# EAGLE design P1001-001-013-320 - Bus Debugger (EAGLE 9.4.2)
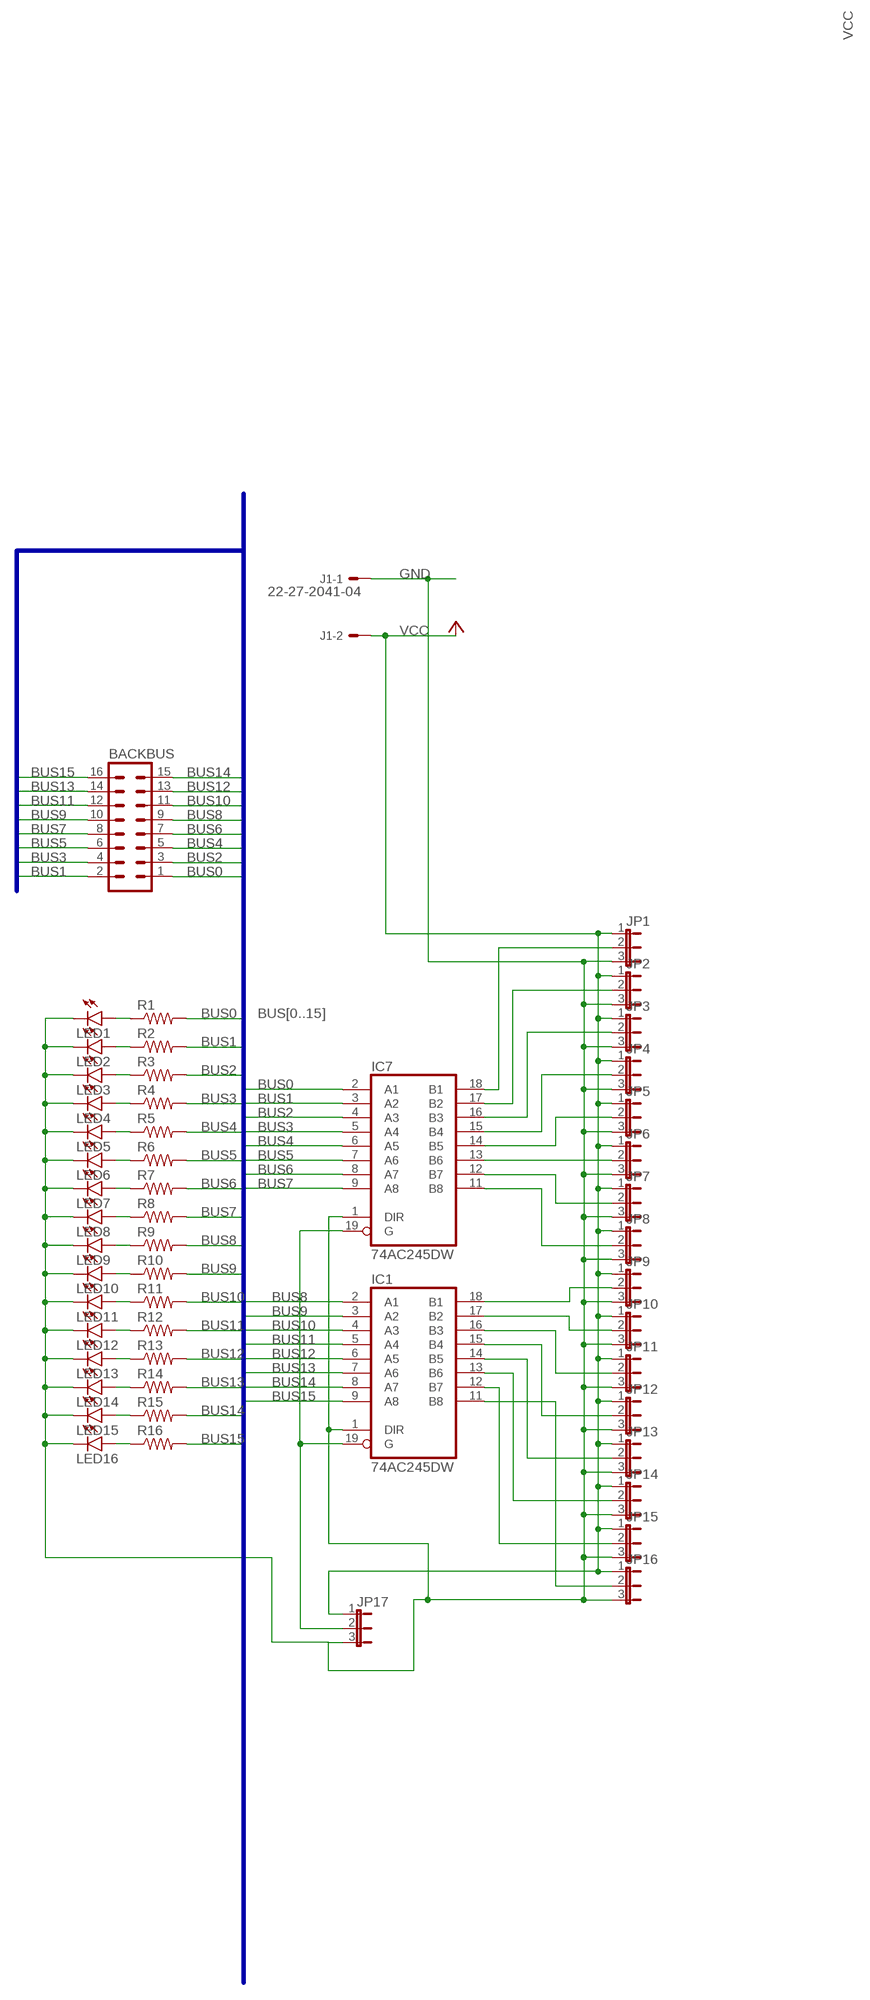
[diagram p0: schematic, sheet 1]

## Parts
BACKBUS  ML16  [ML16]
IC1  74AC245DW  [SO20W]
IC7  74AC245DW  [SO20W]
J1  22-27-2041-04  [6410-04]
JP1  JP2E  [JP2]
JP2  JP2E  [JP2]
JP3  JP2E  [JP2]
JP4  JP2E  [JP2]
JP5  JP2E  [JP2]
JP6  JP2E  [JP2]
JP7  JP2E  [JP2]
JP8  JP2E  [JP2]
JP9  JP2E  [JP2]
JP10  JP2E  [JP2]
JP11  JP2E  [JP2]
JP12  JP2E  [JP2]
JP13  JP2E  [JP2]
JP14  JP2E  [JP2]
JP15  JP2E  [JP2]
JP16  JP2E  [JP2]
JP17  JP2E  [JP2]
LED1  LED5MM  [LED5MM]
LED2  LED5MM  [LED5MM]
LED3  LED5MM  [LED5MM]
LED4  LED5MM  [LED5MM]
LED5  LED5MM  [LED5MM]
LED6  LED5MM  [LED5MM]
LED7  LED5MM  [LED5MM]
LED8  LED5MM  [LED5MM]
LED9  LED5MM  [LED5MM]
LED10  LED5MM  [LED5MM]
LED11  LED5MM  [LED5MM]
LED12  LED5MM  [LED5MM]
LED13  LED5MM  [LED5MM]
LED14  LED5MM  [LED5MM]
LED15  LED5MM  [LED5MM]
LED16  LED5MM  [LED5MM]
R1  R-US_0204/2V  [0204V]
R2  R-US_0204/2V  [0204V]
R3  R-US_0204/2V  [0204V]
R4  R-US_0204/2V  [0204V]
R5  R-US_0204/2V  [0204V]
R6  R-US_0204/2V  [0204V]
R7  R-US_0204/2V  [0204V]
R8  R-US_0204/2V  [0204V]
R9  R-US_0204/2V  [0204V]
R10  R-US_0204/2V  [0204V]
R11  R-US_0204/2V  [0204V]
R12  R-US_0204/2V  [0204V]
R13  R-US_0204/2V  [0204V]
R14  R-US_0204/2V  [0204V]
R15  R-US_0204/2V  [0204V]
R16  R-US_0204/2V  [0204V]

## Nets
BUS0: BACKBUS.1 IC7.2(A1) R1.2
BUS1: BACKBUS.2 IC7.3(A2) R2.2
BUS2: BACKBUS.3 IC7.4(A3) R3.2
BUS3: BACKBUS.4 IC7.5(A4) R4.2
BUS4: BACKBUS.5 IC7.6(A5) R5.2
BUS5: BACKBUS.6 IC7.7(A6) R6.2
BUS6: BACKBUS.7 IC7.8(A7) R7.2
BUS7: BACKBUS.8 IC7.9(A8) R8.2
BUS8: BACKBUS.9 IC1.2(A1) R9.2
BUS9: BACKBUS.10 IC1.3(A2) R10.2
BUS10: BACKBUS.11 IC1.4(A3) R11.2
BUS11: BACKBUS.12 IC1.5(A4) R12.2
BUS12: BACKBUS.13 IC1.6(A5) R13.2
BUS13: BACKBUS.14 IC1.7(A6) R14.2
BUS14: BACKBUS.15 IC1.8(A7) R15.2
BUS15: BACKBUS.16 IC1.9(A8) R16.2
GND [power]: IC1.1(DIR) IC7.1(DIR) J1.1 JP1.3 JP2.3 JP3.3 JP4.3 JP5.3 JP6.3 JP7.3 JP8.3 JP9.3 JP10.3 JP11.3 JP12.3 JP13.3 JP14.3 JP15.3 JP16.3 JP17.3 LED1.K(C) LED2.K(C) LED3.K(C) LED4.K(C) LED5.K(C) LED6.K(C) LED7.K(C) LED8.K(C) LED9.K(C) LED10.K(C) LED11.K(C) LED12.K(C) LED13.K(C) LED14.K(C) LED15.K(C) LED16.K(C)
N$1: IC7.18(B1) JP1.2
N$2: IC7.17(B2) JP2.2
N$3: IC7.16(B3) JP3.2
N$4: IC7.15(B4) JP4.2
N$5: IC7.14(B5) JP5.2
N$6: IC7.13(B6) JP6.2
N$7: IC7.12(B7) JP7.2
N$8: IC7.11(B8) JP8.2
N$11: IC1.18(B1) JP9.2
N$12: IC1.17(B2) JP10.2
N$13: IC1.16(B3) JP11.2
N$14: IC1.15(B4) JP12.2
N$15: IC1.14(B5) JP13.2
N$16: IC1.13(B6) JP14.2
N$17: IC1.12(B7) JP15.2
N$18: IC1.11(B8) JP16.2
N$19: IC1.19(G) IC7.19(G) JP17.2
N$21: LED13.A R13.1
N$22: LED14.A R14.1
N$23: LED15.A R15.1
N$24: LED16.A R16.1
N$25: LED8.A R8.1
N$26: LED7.A R7.1
N$27: LED6.A R6.1
N$28: LED5.A R5.1
N$29: LED4.A R4.1
N$30: LED3.A R3.1
N$31: LED2.A R2.1
N$32: LED1.A R1.1
N$33: LED9.A R9.1
N$34: LED10.A R10.1
N$35: LED11.A R11.1
N$36: LED12.A R12.1
VCC [power]: J1.2 JP1.1 JP2.1 JP3.1 JP4.1 JP5.1 JP6.1 JP7.1 JP8.1 JP9.1 JP10.1 JP11.1 JP12.1 JP13.1 JP14.1 JP15.1 JP16.1 JP17.1
Unconnected: J1.3 J1.4

## Buses
BUS[0..15]

## Power pins joined to a net without a drawn wire
GND: IC1.10(GND) IC7.10(GND)
VCC: IC1.20(VCC) IC7.20(VCC)

## Library data of the parts
BACKBUS = con-harting-ml:ML16: HARTING; OC_FARNELL: unknown; OC_NEWARK: unknown
IC1 IC7 = 74xx-eu:74*245: Octal BUS TRANSCEIVER, 3-state
J1 = con-molex:22-?-04: CONNECTOR wire to board 2.54 mm (.1 inch) pitch header; MF: MOLEX; OC_FARNELL: unknown; OC_NEWARK: unknown
JP1-JP17 = jumper:JP2E: JUMPER
LED1-LED16 = led:LED: LED OSRAM: - CHIPLED LG R971, LG N971, LY N971, LG Q971, LY Q971, LO R971, LY R971 LH N974, LH R974 LS Q976, LO Q976, LY Q976 LO Q996 - Hyper CHIPLED LW Q18S LB Q993, LB Q99A, LB R99A - SideLED LS A670, LO A670, LY A670, LG A670, LP A670 LB A673, LV A673, LT A673, LW A673 LH A674 LY A675 LS A676, LA A676, LO A676, LY A676, LW A676 LS A679, LY A679, LG A679 - Hyper Micro SIDELED® LS Y876, LA Y876, LO Y876, LY Y876 LT Y87S - SmartLED LW L88C, LW L88S LB L89C, LB L89S, LG L890 LS L89K, LO L89K, LY L89K LS L896, LA L896, LO L896, LY L896 - TOPLED LS T670, LO T670, LY T670, LG T670, LP T670 LSG T670, LSP T670, LSY T670, LOP T670, LYG T670 LG T671, LOG T671, LSG T671 LB T673, LV T673, LT T673, LW T673 LH T674 LS T676, LA T676, LO T676, LY T676, LB T676, LH T676, LSB T676, LW T676 LB T67C, LV T67C, LT T67C, LS T67K, LO T67K, LY T67K, LW E67C LS E67B, LA E67B, LO E67B, LY E67B, LB E67C, LV E67C, LT E67C LW T67C LS T679, LY T679, LG T679 LS T770, LO T770, LY T770, LG T770, LP T770 LB T773, LV T773, LT T773, LW T773 LH T774 LS E675, LA E675, LY E675, LS T675 LS T776, LA T776, LO T776, LY T776, LB T776 LHGB T686 LT T68C, LB T68C - Hyper Mini TOPLED® LB M676 - Mini TOPLED Santana® LG M470 LS M47K, LO M47K, LY M47K Source: http://www.osram.convergy.de LUXEON: - LUMILED® LXK2-PW12-R00, LXK2-PW12-S00, LXK2-PW14-U00, LXK2-PW14-V00 LXK2-PM12-R00, LXK2-PM12-S00, LXK2-PM14-U00 LXK2-PE12-Q00, LXK2-PE12-R00, LXK2-PE12-S00, LXK2-PE14-T00, LXK2-PE14-U00 LXK2-PB12-K00, LXK2-PB12-L00, LXK2-PB12-M00, LXK2-PB14-N00, LXK2-PB14-P00, LXK2-PB14-Q00 LXK2-PR12-L00, LXK2-PR12-M00, LXK2-PR14-Q00, LXK2-PR14-R00 LXK2-PD12-Q00, LXK2-PD12-R00, LXK2-PD12-S00 LXK2-PH12-R00, LXK2-PH12-S00 LXK2-PL12-P00, LXK2-PL12-Q00, LXK2-PL12-R00 Source: www.luxeon.com KINGBRIGHT: KA-3528ASYC Source: www.kingbright.com
R1-R16 = rcl:R-US_: RESISTOR, American symbol; SPICEPREFIX: R

## Net classes
2 power: width 0.457 mm

## Board
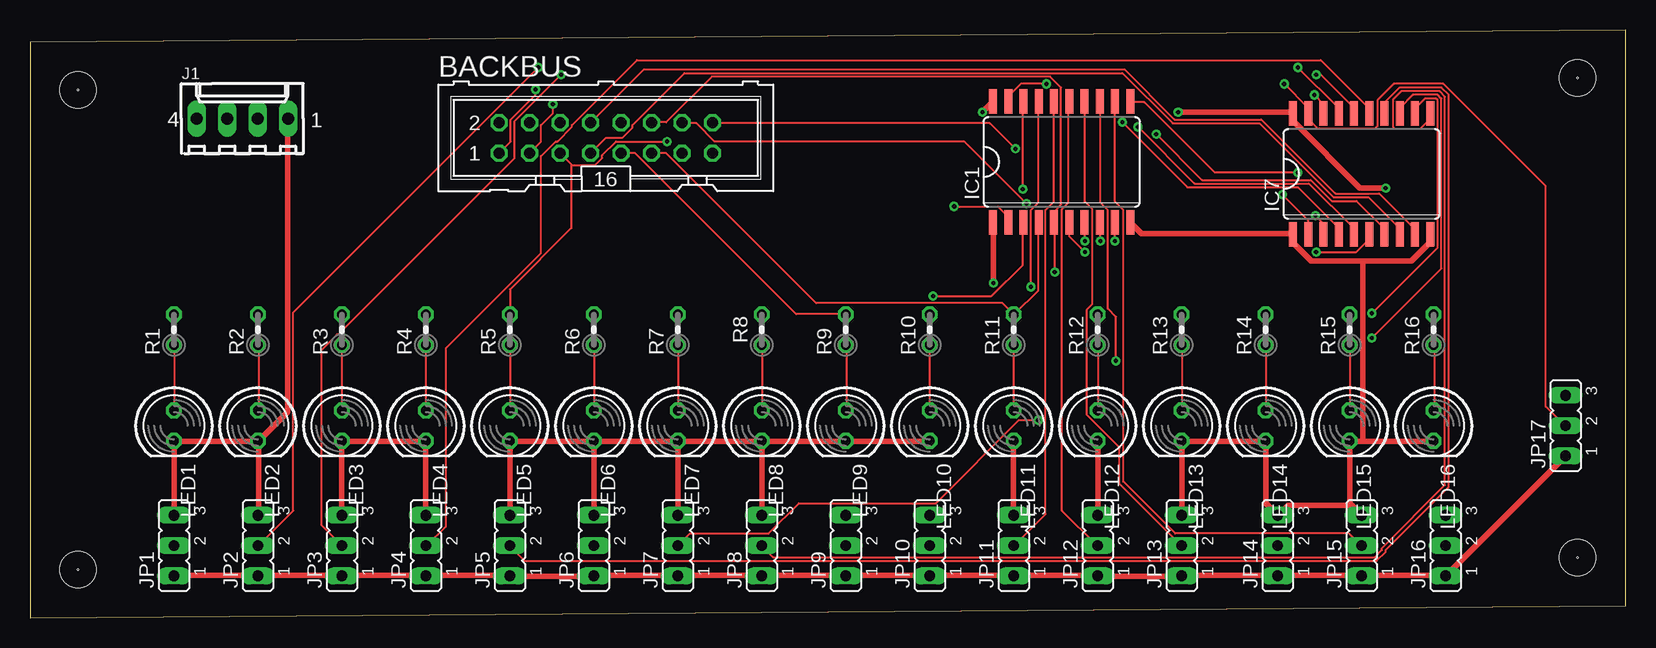
[diagram p1: board, top side]
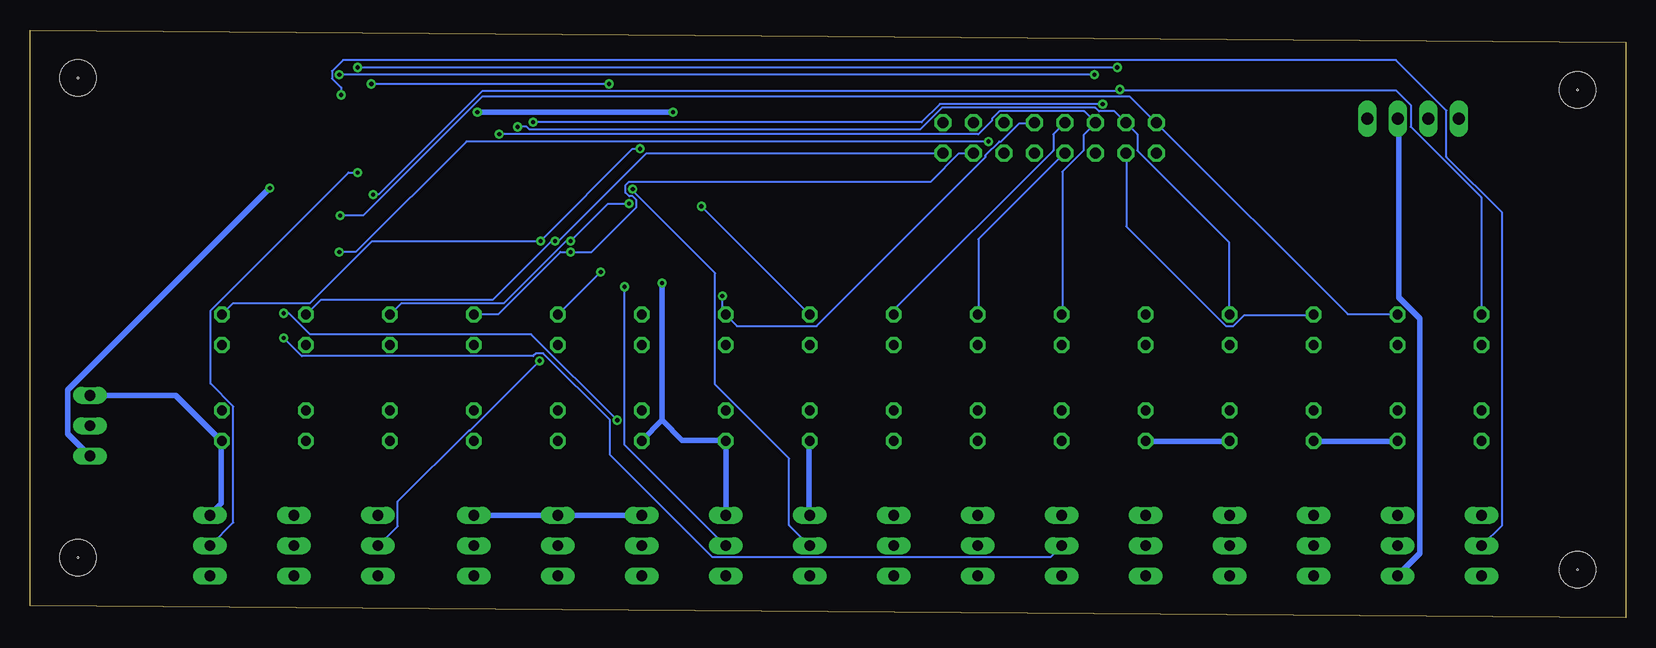
[diagram p2: board, bottom side, seen from below]

Size 133 x 49 mm. Coordinates in mm from the lower left corner, seen from the top.
Outline: 0,0 133,1 133,49 0,48 0,0
Copper layers (1*16): Top 0.035mm / dielectric 1.5mm / Bottom 0.035mm
Design rules "default *": minimum track width 6mil, minimum drill 0.35mm, track to track 6mil, track to pad 6mil, pad to pad 6mil, via to via 6mil, smd to smd 6mil, copper to edge 40mil, drill to drill 6mil, minimum pad ring 10mil, minimum via ring 8mil, stop-mask expansion 4mil, vias tented up to drill 0mil, thermal gap 10mil
Holes 0.12 mm at 4,4 129,45 4,44 129,5
Holes 3 mm at 4,44 4,4 129,5 129,45

### Footprints (pad centres in the part's own frame; a part is rotated, then mirrored left to right if it is on the bottom)
ML16 = drill 0.914 octagon: 1 -8.89,-1.27; 2 -8.89,1.27; 3 -6.35,-1.27; 4 -6.35,1.27; 5 -3.81,-1.27; 6 -3.81,1.27; 7 -1.27,-1.27; 8 -1.27,1.27; 9 1.27,-1.27; 10 1.27,1.27; 11 3.81,-1.27; 12 3.81,1.27; 13 6.35,-1.27; 14 6.35,1.27; 15 8.89,-1.27; 16 8.89,1.27
SO20W = smd 0.66 x 2.032: 1 -5.715,-5.029; 2 -4.445,-5.029; 3 -3.175,-5.029; 4 -1.905,-5.029; 5 -0.635,-5.029; 6 0.635,-5.029; 7 1.905,-5.029; 8 3.175,-5.029; 9 4.445,-5.029; 10 5.715,-5.029; 11 5.715,5.029; 12 4.445,5.029; 13 3.175,5.029; 14 1.905,5.029; 15 0.635,5.029; 16 -0.635,5.029; 17 -1.905,5.029; 18 -3.175,5.029; 19 -4.445,5.029; 20 -5.715,5.029
6410-04 = drill 1.016 long: 1 3.81,0; 2 1.27,0; 3 -1.27,0; 4 -3.81,0
JP2 = drill 0.914 long: 1 -2.54,0; 2 0,0; 3 2.54,0
LED5MM = drill 0.813 octagon: A -1.27,0; K 1.27,0
0204V = drill 0.813 octagon: 1 -1.27,0; 2 1.27,0

### Placement (x,y rotation side)
BACKBUS  48,40 0 top
IC1  86,38 0 top
IC7  111,37 0 top
J1  17.7,41.61 0 top
JP1  12,6 90 top
JP2  19,6 90 top
JP3  26,6 90 top
JP4  33,6 90 top
JP5  40,6 90 top
JP6  47,6 90 top
JP7  54,6 90 top
JP8  61,6 90 top
JP9  68,6 90 top
JP10  75,6 90 top
JP11  82,6 90 top
JP12  89,6 90 top
JP13  96,6 90 top
JP14  104,6 90 top
JP15  111,6 90 top
JP16  118,6 90 top
JP17  128,16 90 top
LED1  12,16 270 top
LED2  19,16 270 top
LED3  26,16 270 top
LED4  33,16 270 top
LED5  40,16 270 top
LED6  47,16 270 top
LED7  54,16 270 top
LED8  61,16 270 top
LED9  68,16 270 top
LED10  75,16 270 top
LED11  82,16 270 top
LED12  89,16 270 top
LED13  96,16 270 top
LED14  103,16 270 top
LED15  110,16 270 top
LED16  117,16 270 top
R1  12,24 90 top
R2  19,24 90 top
R3  26,24 90 top
R4  33,24 90 top
R5  40,24 90 top
R6  47,24 90 top
R7  54,24 90 top
R8  61,24 90 top
R9  68,24 90 top
R10  75,24 90 top
R11  82,24 90 top
R12  89,24 90 top
R13  96,24 90 top
R14  103,24 90 top
R15  110,24 90 top
R16  117,24 90 top

### Tracks (layer width: path | path; a pad name or v marks a point on that pad's centre or on a via)
BUS0  (via drill 0.35)
  Top 0.152: v104.39,35.28 106.53,33.15 106.53,32 IC7.2 | v42.14,44.04 42.14,43.59 40.08,41.53 40.08,39.7 39.17,38.79 BACKBUS.1
  Bottom 0.152: v104.39,35.28 103.94,35.28 95.33,43.89 42.29,43.89 v42.14,44.04 42.14,43.97 19.13,43.97 17.91,42.75 17.91,40.92 12.04,35.05 12.04,25.3 R1.2
BUS1  (via drill 0.35)
  Top 0.152: v107.14,33.53 107.82,32.84 107.82,32 IC7.3
  Bottom 0.152: v107.14,33.53 105.23,33.53 95.33,43.43 41.3,43.43 39.17,41.3 BACKBUS.2 39.09,41.22 23.16,25.3 19.05,25.3 R2.2
BUS2  (via drill 0.35)
  Top 0.152: v91.06,41.3 96.47,35.89 105.69,35.89 109.04,32.54 109.04,32 IC7.4 | v43.59,42.82 43.59,42.06 42.6,41.07 42.6,39.7 41.68,38.79 BACKBUS.3
  Bottom 0.152: v91.06,41.3 58.67,41.3 57.15,42.82 v43.59,42.82 | R3.2 26.06,25.22 31.77,25.22 32.69,24.31 33.3,24.31 41.6,32.61 41.6,38.71 BACKBUS.3
BUS3  (via drill 0.35)
  Top 0.152: v92.35,40.92 97.08,36.2 106.6,36.2 110.34,32.46 110.34,32 IC7.5
  Bottom 0.152: v92.35,40.92 91.59,40.92 91.36,40.69 58.83,40.69 57,42.52 44.2,42.52 43.89,42.22 42.6,42.22 41.68,41.3 BACKBUS.4 41.6,41.22 40.69,40.31 40.69,38.94 33.07,31.32 33.07,25.3 R4.2
BUS4  (via drill 0.35)
  Top 0.152: v107.21,30.48 110.57,30.48 111.63,31.55 111.63,31.93 IC7.6 | v53.11,39.7 48.84,39.7 47.7,38.56 47.7,38.33 47.09,37.72 45.19,37.72 45.15,37.76 | 45.15,37.76 44.2,38.71 BACKBUS.5 | R5.2 40.01,25.3 40.01,27.36 45.11,32.46 45.11,37.72 45.15,37.76
  Bottom 0.152: v107.21,30.48 105.84,30.48 96.62,39.7 v53.11,39.7
BUS5  (via drill 0.35)
  Top 0.152: v93.88,40.31 97.69,36.5 106.76,36.5 108.51,34.75 110.57,34.75 112.85,32.46 112.85,32 IC7.7
  Bottom 0.152: v93.88,40.31 53.95,40.31 52.81,41.45 52.81,41.6 52.2,42.22 45.11,42.22 44.2,41.3 BACKBUS.6 44.2,41.22 45.19,40.23 45.19,38.94 46.94,37.19 46.94,25.3 R6.2
BUS6
  Top 0.152: IC7.8 114.15,32 114.15,32.46 111.56,35.05 108.66,35.05 102.49,41.22 95.25,41.22 91.06,45.41 54.56,45.41 50.22,41.07 50.22,40.84 49.38,40.01 48.01,40.01 46.79,38.79 BACKBUS.7
  Bottom 0.152: R7.2 53.95,25.3 53.95,31.55 46.79,38.71 BACKBUS.7
BUS7
  Top 0.152: IC7.9 115.44,32 115.44,32.38 112.47,35.36 108.81,35.36 102.64,41.53 95.4,41.53 91.21,45.72 51.21,45.72 46.79,41.3 BACKBUS.8
  Bottom 0.152: R8.2 60.96,25.3 60.96,25.68 47.7,38.94 47.7,40.31 46.79,41.22 BACKBUS.8
BUS8  (via drill 0.35)
  Top 0.152: v77.04,34.29 80.7,34.29 81.53,33.45 81.53,32.99 IC1.2 | BACKBUS.9 49.3,38.71 50.44,38.71 63.86,25.3 67.97,25.3 R9.2
  Bottom 0.152: v77.04,34.29 68.05,25.3 R9.2
BUS9  (via drill 0.35)
  Top 0.152: v75.29,26.82 80.16,26.82 82.75,29.41 82.75,32.92 IC1.3
  Bottom 0.152: v75.29,26.82 75.29,25.53 75.06,25.3 R10.2 74.98,25.22 74.07,24.31 67.44,24.31 53.34,38.41 53.34,38.56 52.2,39.7 52.05,39.7 50.52,41.22 49.3,41.22 BACKBUS.10
BUS10
  Top 0.152: IC1.4 84.05,32.92 84.05,27.28 82.07,25.3 R11.2 81.99,25.3 81.08,26.21 65.53,26.21 53.03,38.71 51.82,38.71 BACKBUS.11
BUS11  (via drill 0.35)
  Top 0.152: v85.42,28.8 85.42,32.92 IC1.5 85.42,32.99 85.42,33.91 85.95,34.44 85.95,44.2 85.04,45.11 56.84,45.11 53.03,41.3 51.82,41.3 BACKBUS.12
  Bottom 0.152: v85.42,28.8 88.92,25.3 R12.2
BUS12  (via drill 0.35)
  Top 0.152: v87.94,30.48 86.64,31.77 86.64,32.92 IC1.6
  Bottom 0.152: R13.2 95.94,25.3 93.95,25.3 88.77,30.48 v87.94,30.48 86.18,30.48 82.45,34.21 82.45,34.82 82.75,35.13 83.06,35.13 83.36,35.43 83.36,36.04 83.06,36.35 57.91,36.35 55.55,38.71 54.41,38.71 BACKBUS.13
BUS13  (via drill 0.35)
  Top 0.152: v87.94,31.39 87.94,32.92 IC1.7 | v83.06,34.52 77.88,39.7 57.07,39.7 55.55,41.22 54.41,41.22 BACKBUS.14
  Bottom 0.152: R14.2 102.95,25.3 102.03,26.21 93.5,26.21 88.32,31.39 v87.94,31.39 84.81,34.52 v83.06,34.52
BUS14  (via drill 0.35)
  Top 0.152: v89.23,31.39 89.23,32.92 IC1.8
  Bottom 0.152: R15.2 109.96,25.3 108.74,26.52 94.41,26.52 89.53,31.39 v89.23,31.39 88.92,31.39 81.61,38.71 56.92,38.71 BACKBUS.15
BUS15  (via drill 0.35)
  Top 0.152: v90.45,31.39 90.45,32.92 IC1.9 | v82.14,39.09 80.01,41.22 56.92,41.22 BACKBUS.16
  Bottom 0.152: R16.2 116.97,25.3 116.05,26.21 109.65,26.21 104.47,31.39 v90.45,31.39 82.75,39.09 v82.14,39.09
GND  (via drill 0.35)
  Top 0.457: IC1.10 91.75,32.92 92.66,32 105.23,32 IC7.1 105.39,31.77 105.39,31.17 106.83,29.72 111.1,29.72 | 111.1,29.72 115.14,29.72 116.66,31.24 116.66,31.93 IC7.10 | 110.03,9.53 110.03,14.71 LED15.K 110.26,14.71 111.1,14.71 | 110.03,9.53 110.95,8.61 JP15.3 | JP13.3 96.01,8.61 96.01,14.71 LED13.K 96.24,14.71 102.79,14.71 LED14.K 103.02,14.71 103.02,9.53 103.94,8.61 JP14.3 104.17,8.69 104.85,9.37 109.88,9.37 110.03,9.53 | 111.1,14.71 116.97,14.71 LED16.K | 111.1,14.71 111.1,29.72 | JP1.3 12.04,8.61 12.04,14.71 LED1.K 12.27,14.71 18.82,14.71 LED2.K | LED2.K 19.05,14.71 19.05,8.61 JP2.3 | J1.1 21.49,41.6 21.49,17.14 19.2,14.86 LED2.K | LED12.K 89,14.71 89,8.61 JP12.3 | v80.31,27.89 80.31,32.92 IC1.1 | JP11.3 81.99,8.61 81.99,14.71 LED11.K | LED7.K 54.03,14.71 54.03,8.61 JP7.3 | LED8.K 61.04,14.71 61.04,8.61 JP8.3 | LED7.K 54.25,14.71 60.81,14.71 LED8.K | LED8.K 61.27,14.71 67.97,14.71 LED9.K 68.2,14.71 74.98,14.71 LED10.K | JP3.3 25.98,8.61 25.98,14.71 LED3.K 26.21,14.71 32.77,14.71 LED4.K 32.99,14.71 32.99,8.61 JP4.3 | JP5.3 40.01,8.61 40.01,14.71 LED5.K 40.23,14.71 46.79,14.71 LED6.K | LED6.K 47.02,14.71 47.02,8.61 JP6.3 | LED7.K 53.8,14.71 47.24,14.71 LED6.K
  Bottom 0.457: JP16.3 117.96,8.61 117.04,9.53 117.04,14.71 LED16.K 117.2,14.86 120.85,18.52 127.94,18.52 JP17.3 | 80.31,16.46 v80.31,27.89 | 80.31,16.46 81.99,14.78 LED11.K | 80.31,16.46 78.64,14.78 75.06,14.78 LED10.K 74.98,14.55 74.98,8.61 JP10.3 | JP11.3 82.07,8.53 88.92,8.53 JP12.3 89.15,8.53 95.94,8.53 JP13.3 | LED9.K 68.05,14.71 68.05,8.61 JP9.3 | LED4.K 33.07,14.71 39.93,14.71 LED5.K | LED2.K 19.05,14.71 25.98,14.71 LED3.K
N$1  (via drill 0.35)
  Top 0.152: v107.06,43.59 107.82,42.82 107.82,42.06 IC7.18
  Bottom 0.152: v107.06,43.59 107.06,44.2 107.82,44.96 107.82,45.57 106.91,46.48 19.13,46.48 14.94,42.29 14.94,38.41 10.29,33.76 10.29,7.7 11.96,6.02 JP1.2
N$2  (via drill 0.35)
  Top 0.152: v105.69,45.87 109.04,42.52 109.04,42.06 IC7.17 | v42.37,45.87 21.95,25.45 21.95,8.91 19.05,6.02 JP2.2
  Bottom 0.152: v42.37,45.87 v105.69,45.87
N$3  (via drill 0.35)
  Top 0.152: v107.21,45.26 107.59,45.26 110.34,42.52 110.34,42.06 IC7.16 | v44.27,45.26 40.39,41.38 40.39,38.33 25.68,23.62 25.6,23.62 24.31,22.33 24.31,7.7 25.98,6.02 JP3.2
  Bottom 0.152: v44.27,45.26 v107.21,45.26
N$4
  Top 0.152: IC7.15 111.63,42.06 111.63,42.44 107.59,46.48 50.6,46.48 45.19,41.07 45.19,40.92 43.97,39.7 43.81,39.7 42.6,38.48 42.6,30.4 34.67,22.48 34.67,7.62 33.07,6.02 JP4.2
N$5
  Top 0.152: IC7.14 112.93,42.06 112.93,42.98 114.15,44.2 117.65,44.2 118.26,43.59 118.26,10.9 113,5.64 113,5.49 112.24,4.72 41.22,4.72 40.01,5.94 JP5.2
N$6  (via drill 0.35)
  Top 0.152: v111.86,23.32 117.65,29.11 117.65,43.28 117.35,43.59 115.29,43.59 114.22,42.52 114.22,42.06 IC7.13
  Bottom 0.152: v111.86,23.32 110.34,21.79 91.06,21.79 90.83,22.02 90.22,22.02 84.66,16.46 84.66,13.56 76.12,5.03 47.93,5.03 47.02,5.94 JP6.2
N$7  (via drill 0.35)
  Top 0.152: v111.86,25.38 117.35,30.86 117.35,43.13 117.2,43.28 116.28,43.28 115.52,42.52 115.52,42.06 IC7.12 | v84.05,16.46 82.45,16.46 75.51,9.53 64.08,9.53 61.57,7.01 55.02,7.01 54.03,6.02 JP7.2
  Bottom 0.152: v111.86,25.38 111.4,25.38 109.65,23.62 91.21,23.62 v84.05,16.46
N$8
  Top 0.152: IC7.11 116.66,41.99 116.66,41.53 115.9,40.77 113.77,40.77 113.61,40.92 113.61,43.2 114.3,43.89 117.5,43.89 117.96,43.43 117.96,11.05 112.7,5.79 112.7,5.64 112.09,5.03 61.95,5.03 61.04,5.94 JP8.2
N$11  (via drill 0.35)
  Top 0.152: v82.75,35.74 82.75,42.98 IC1.18
  Bottom 0.152: v82.75,35.74 82.75,35.59 75.89,28.73 75.89,19.43 69.72,13.26 69.72,7.7 68.05,6.02 JP9.2
N$12  (via drill 0.35)
  Top 0.152: v83.44,27.58 83.44,33.98 84.05,34.59 84.05,42.98 IC1.17
  Bottom 0.152: v83.44,27.58 83.44,14.4 75.06,6.02 JP10.2
N$13
  Top 0.152: IC1.16 85.34,42.98 85.34,34.67 84.66,33.98 84.66,8.61 82.07,6.02 JP11.2
N$14
  Top 0.152: IC1.15 86.56,42.98 86.56,34.59 86.03,34.06 86.03,8.91 88.92,6.02 JP12.2
N$15
  Top 0.152: IC1.14 87.94,42.98 87.94,34.67 88.54,34.06 88.54,26.14 88.09,25.68 88.09,16.92 90.83,14.17 90.83,11.12 95.94,6.02 JP13.2
N$16  (via drill 0.35)
  Top 0.152: v90.53,21.41 90.53,25.07 89.84,25.76 89.84,33.98 89.23,34.59 89.23,42.98 IC1.13
  Bottom 0.152: v90.53,21.41 96.32,15.62 96.39,15.62 102.34,9.68 102.34,7.62 103.94,6.02 JP14.2
N$17
  Top 0.152: IC1.12 90.45,42.98 90.45,34.67 91.14,33.98 91.14,11.35 95.48,7.01 109.96,7.01 110.95,6.02 JP15.2
N$18  (via drill 0.35)
  Top 0.152: v105.69,37.11 98.75,37.11 92.89,42.98 91.75,42.98 IC1.11
  Bottom 0.152: v105.69,37.11 106.45,37.11 117.96,25.6 117.96,19.51 116.05,17.6 116.05,7.92 117.96,6.02 JP16.2
N$19  (via drill 0.35)
  Top 0.152: JP17.2 127.94,16 126.34,17.6 126.34,35.97 117.81,44.5 113.69,44.5 112.32,43.13 112.32,41 112.09,40.77 107.37,40.77 106.6,41.53 106.6,41.99 IC7.19 106.53,42.06 106.53,42.52 v104.55,44.5 | v84.73,44.5 82.6,44.5 81.61,43.51 81.61,43.05 IC1.19
  Bottom 0.152: v104.55,44.5 v84.73,44.5
N$21
  Top 0.152: LED13.A 96.01,17.3 96.01,22.71 R13.1
N$22
  Top 0.152: LED14.A 103.02,17.3 103.02,22.71 R14.1
N$23
  Top 0.152: LED15.A 110.03,17.3 110.03,22.71 R15.1
N$24
  Top 0.152: LED16.A 117.04,17.3 117.04,22.71 R16.1
N$25
  Top 0.152: LED8.A 61.04,17.3 61.04,22.71 R8.1
N$26
  Top 0.152: LED7.A 54.03,17.3 54.03,22.71 R7.1
N$27
  Top 0.152: LED6.A 47.02,17.3 47.02,22.71 R6.1
N$28
  Top 0.152: LED5.A 40.01,17.3 40.01,22.71 R5.1
N$29
  Top 0.152: LED4.A 32.99,17.3 32.99,22.71 R4.1
N$30
  Top 0.152: LED3.A 25.98,17.3 25.98,22.71 R3.1
N$31
  Top 0.152: LED2.A 19.05,17.3 19.05,22.71 R2.1
N$32
  Top 0.152: LED1.A 12.04,17.3 12.04,22.71 R1.1
N$33
  Top 0.152: LED9.A 68.05,17.3 68.05,22.71 R9.1
N$34
  Top 0.152: LED10.A 74.98,17.3 74.98,22.71 R10.1
N$35
  Top 0.152: LED11.A 81.99,17.3 81.99,22.71 R11.1
N$36
  Top 0.152: LED12.A 89,17.3 89,22.71 R12.1
VCC  (via drill 0.35)
  Top 0.457: v79.4,42.14 80.24,42.98 IC1.20 | v95.71,42.14 105.16,42.14 105.23,42.06 IC7.20 105.39,41.83 105.39,41.3 110.87,35.81 v113,35.81 | JP17.1 127.94,13.41 118.11,3.58 JP16.1 117.96,3.5 111.18,3.5 JP15.1 110.95,3.5 104.01,3.5 JP14.1 103.78,3.5 96.16,3.5 JP13.1 95.94,3.43 89.23,3.43 JP12.1 88.92,3.5 82.22,3.5 JP11.1 81.99,3.5 75.21,3.5 JP10.1 74.98,3.5 68.2,3.5 JP9.1 67.97,3.5 61.19,3.5 JP8.1 60.96,3.5 54.18,3.5 JP7.1 53.95,3.5 47.17,3.5 JP6.1 46.94,3.43 40.23,3.43 JP5.1 39.93,3.5 33.22,3.5 JP4.1 32.99,3.5 26.21,3.5 JP3.1 25.98,3.5 19.2,3.5 JP2.1 18.97,3.5 12.04,3.5 JP1.1
  Bottom 0.457: v95.71,42.14 v79.4,42.14 | v113,35.81 129.84,18.97 129.84,15.32 128.02,13.49 JP17.1 | J1.2 18.9,41.6 18.9,26.67 17.14,24.92 17.14,5.33 18.97,3.5 JP2.1